# EAGLE design bluetooth_devBoard (EAGLE 6.6.0)
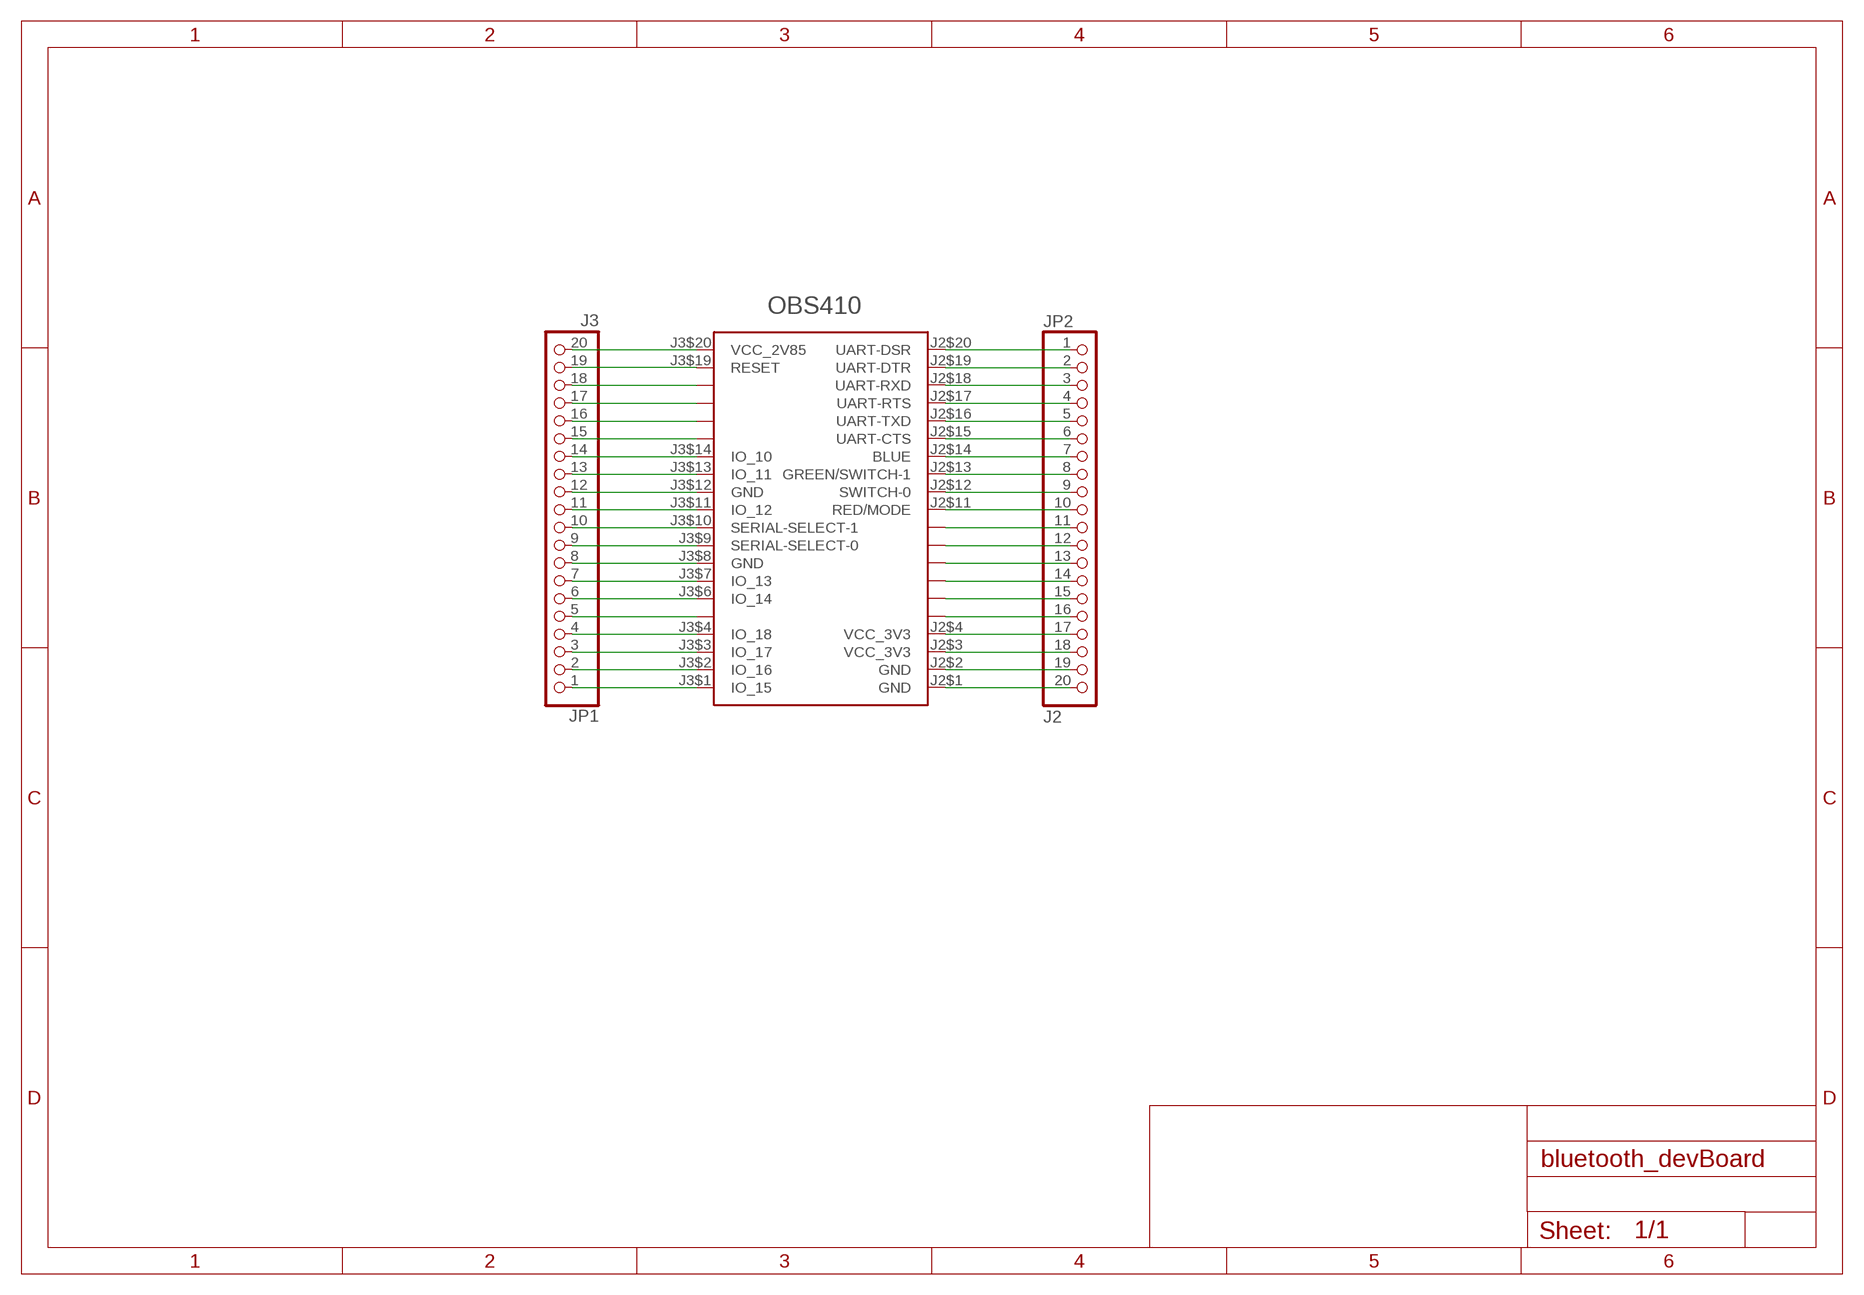
[diagram p0: schematic, sheet 1]

## Parts
JP1  J3  PINHD-1X20  [1X20]
JP2  J2  PINHD-1X20  [1X20]
U$1  OBS410  [SAMTEC-FSI-120-03-G-D-M-AB]

## Nets
GND: JP2.19 JP2.20 U$1.J2$1(GND) U$1.J2$2(GND)
N$1: JP1.20 U$1.J3$20(VCC_2V85)
N$2: JP1.19 U$1.J3$19(RESET)
N$3: JP1.18 U$1.J3$18
N$4: JP1.17 U$1.J3$17
N$5: JP1.16 U$1.J3$16
N$6: JP1.15 U$1.J3$15
N$7: JP1.14 U$1.J3$14(IO_10)
N$8: JP1.13 U$1.J3$13(IO_11)
N$9: JP1.12 U$1.J3$12(GND)
N$10: JP1.11 U$1.J3$11(IO_12)
N$11: JP1.10 U$1.J3$10(SERIAL-SELECT-1)
N$12: JP1.9 U$1.J3$9(SERIAL-SELECT-0)
N$13: JP1.8 U$1.J3$8(GND)
N$14: JP1.7 U$1.J3$7(IO_13)
N$15: JP1.6 U$1.J3$6(IO_14)
N$16: JP1.5 U$1.J3$5
N$17: JP1.4 U$1.J3$4(IO_18)
N$18: JP1.3 U$1.J3$3(IO_17)
N$19: JP1.2 U$1.J3$2(IO_16)
N$20: JP1.1 U$1.J3$1(IO_15)
N$21: JP2.1 U$1.J2$20(UART-DSR)
N$22: JP2.2 U$1.J2$19(UART-DTR)
N$23: JP2.3 U$1.J2$18(UART-RXD)
N$24: JP2.4 U$1.J2$17(UART-RTS)
N$25: JP2.5 U$1.J2$16(UART-TXD)
N$26: JP2.6 U$1.J2$15(UART-CTS)
N$27: JP2.7 U$1.J2$14(BLUE)
N$28: JP2.8 U$1.J2$13(GREEN/SWITCH-1)
N$29: JP2.9 U$1.J2$12(SWITCH-0)
N$30: JP2.10 U$1.J2$11(RED/MODE)
N$31: JP2.11 U$1.J2$10
N$32: JP2.12 U$1.J2$9
N$33: JP2.13 U$1.J2$8
N$34: JP2.14 U$1.J2$7
N$35: JP2.15 U$1.J2$6
N$36: JP2.16 U$1.J2$5
N$37: JP2.17 U$1.J2$4(VCC_3V3)
VCC_3V3: JP2.18 U$1.J2$3(VCC_3V3)

## Library data of the parts
JP1 JP2 = pinhead:PINHD-1X20: PIN HEADER
U$1 = ajgl:OBS410: Bluetooth modul BlueConnect OBS410

## Board
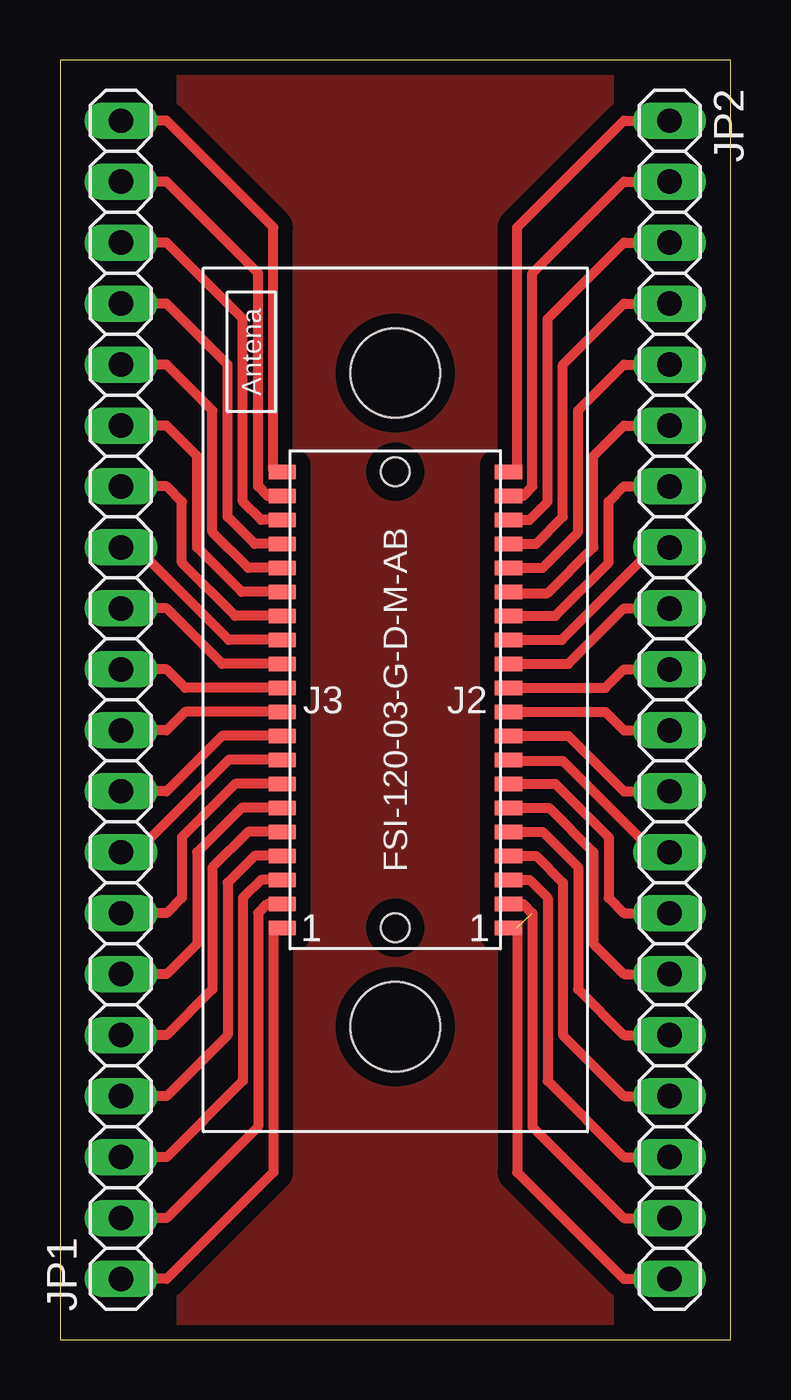
[diagram p1: board, top side]

Size 27.94 x 53.33 mm. Coordinates in mm from the lower left corner, seen from the top.
Outline: 0,0 27.94,0 27.94,53.33 0,53.33 0,0
Copper layers 1: Top 0.035mm
Design rules "design_rules *": minimum track width 30mil, minimum drill 24mil, track to track 2mil, track to pad 5mil, pad to pad 5mil, via to via 5mil, smd to smd 5mil, copper to edge 20mil, drill to drill 8mil, minimum pad ring 10mil, minimum via ring 8mil, stop-mask expansion 4mil, vias tented up to drill 0mil, thermal gap 10mil

### Footprints (pad centres in the part's own frame; a part is rotated, then mirrored left to right if it is on the bottom)
1X20 = drill 1.016 long: 1 -24.13,0; 2 -21.59,0; 3 -19.05,0; 4 -16.51,0; 5 -13.97,0; 6 -11.43,0; 7 -8.89,0; 8 -6.35,0; 9 -3.81,0; 10 -1.27,0; 11 1.27,0; 12 3.81,0; 13 6.35,0; 14 8.89,0; 15 11.43,0; 16 13.97,0; 17 16.51,0; 18 19.05,0; 19 21.59,0; 20 24.13,0
SAMTEC-FSI-120-03-G-D-M-AB = smd 1.14 x 0.61: J2$1 4.71,-9.5; J2$2 4.71,-8.5; J2$3 4.71,-7.5; J2$4 4.71,-6.5; J2$5 4.71,-5.5; J2$6 4.71,-4.5; J2$7 4.71,-3.5; J2$8 4.71,-2.5; J2$9 4.71,-1.5; J2$10 4.71,-0.5; J2$11 4.71,0.5; J2$12 4.71,1.5; J2$13 4.71,2.5; J2$14 4.71,3.5; J2$15 4.71,4.5; J2$16 4.71,5.5; J2$17 4.71,6.5; J2$18 4.71,7.5; J2$19 4.71,8.5; J2$20 4.71,9.5; J3$1 -4.71,-9.5; J3$2 -4.71,-8.5; J3$3 -4.71,-7.5; J3$4 -4.71,-6.5; J3$5 -4.71,-5.5; J3$6 -4.71,-4.5; J3$7 -4.71,-3.5; J3$8 -4.71,-2.5; J3$9 -4.71,-1.5; J3$10 -4.71,-0.5; J3$11 -4.71,0.5; J3$12 -4.71,1.5; J3$13 -4.71,2.5; J3$14 -4.71,3.5; J3$15 -4.71,4.5; J3$16 -4.71,5.5; J3$17 -4.71,6.5; J3$18 -4.71,7.5; J3$19 -4.71,8.5; J3$20 -4.71,9.5 | hole 3.73: 0,-13.62; 0,13.62 | hole 1.2: 0,9.5; 0,-9.5

### Placement (x,y rotation side)
JP1  2.54,26.67 90 top
JP2  25.4,26.67 270 top
U$1  13.97,26.67 0 top

### Tracks (layer width: path | path; a pad name or v marks a point on that pad's centre or on a via)
GND  (1 unrouted)
  Top 0.406: U$1.J2$1 19.02,17.17 19.05,17.14 19.05,6.99 23.5,2.54 JP2.20 | U$1.J2$2 19.3,18.17 19.68,17.78 19.68,8.89 23.5,5.08 JP2.19
N$1
  Top 0.406: JP1.20 4.45,50.8 8.89,46.35 8.89,36.2 8.91,36.17 U$1.J3$20
N$2
  Top 0.406: U$1.J3$19 8.64,35.17 8.26,35.56 8.26,44.45 4.45,48.26 JP1.19
N$3
  Top 0.406: U$1.J3$18 8.38,34.17 7.62,34.92 7.62,42.55 4.45,45.72 JP1.18
N$4
  Top 0.406: U$1.J3$17 8.11,33.17 6.99,34.29 6.99,40.64 4.45,43.18 JP1.17
N$5
  Top 0.406: U$1.J3$16 7.83,32.17 6.35,33.66 6.35,38.73 4.45,40.64 JP1.16
N$6
  Top 0.406: U$1.J3$15 7.57,31.17 5.71,33.02 5.71,36.83 4.45,38.1 JP1.15
N$7
  Top 0.406: U$1.J3$14 7.29,30.17 5.08,32.38 5.08,34.92 4.45,35.56 JP1.14
N$8
  Top 0.406: U$1.J3$13 7.03,29.17 3.17,33.02 JP1.13
N$9
  Top 0.406: U$1.J3$12 6.75,28.17 4.45,30.48 JP1.12
N$10
  Top 0.406: U$1.J3$11 5.21,27.17 4.45,27.94 JP1.11
N$11
  Top 0.406: U$1.J3$10 5.21,26.17 4.45,25.4 JP1.10
N$12
  Top 0.406: U$1.J3$9 6.75,25.17 4.45,22.86 JP1.9
N$13
  Top 0.406: U$1.J3$8 7.03,24.17 3.17,20.32 JP1.8
N$14
  Top 0.406: U$1.J3$7 7.29,23.17 5.08,20.95 5.08,18.41 4.45,17.78 JP1.7
N$15
  Top 0.406: U$1.J3$6 7.57,22.17 5.71,20.32 5.71,16.51 4.45,15.24 JP1.6
N$16
  Top 0.406: U$1.J3$5 7.83,21.17 6.35,19.68 6.35,14.61 4.45,12.7 JP1.5
N$17
  Top 0.406: U$1.J3$4 8.11,20.17 6.99,19.05 6.99,12.7 4.45,10.16 JP1.4
N$18
  Top 0.406: U$1.J3$3 8.38,19.17 7.62,18.41 7.62,10.79 4.45,7.62 JP1.3
N$19
  Top 0.406: U$1.J3$2 8.64,18.17 8.26,17.78 8.26,8.89 4.45,5.08 JP1.2
N$20
  Top 0.406: JP1.1 4.45,2.54 8.89,6.99 8.89,17.14 8.91,17.17 U$1.J3$1
N$21
  Top 0.406: U$1.J2$20 19.02,36.17 19.05,36.2 19.05,46.35 23.5,50.8 JP2.1
N$22
  Top 0.406: U$1.J2$19 19.3,35.17 19.68,35.56 19.68,44.45 23.5,48.26 JP2.2
N$23
  Top 0.406: U$1.J2$18 19.57,34.17 20.32,34.92 20.32,42.55 23.5,45.72 JP2.3
N$24
  Top 0.406: U$1.J2$17 19.84,33.17 20.95,34.29 20.95,40.64 23.5,43.18 JP2.4
N$25
  Top 0.406: U$1.J2$16 20.11,32.17 21.59,33.66 21.59,38.73 23.5,40.64 JP2.5
N$26
  Top 0.406: U$1.J2$15 18.47,31.17 18.41,31.11 20.32,31.11 22.23,33.02 22.23,36.83 23.5,38.1 JP2.6
N$27
  Top 0.406: U$1.J2$14 20.64,30.17 22.86,32.38 22.86,34.92 23.5,35.56 JP2.7
N$28
  Top 0.406: U$1.J2$13 20.91,29.17 24.77,33.02 JP2.8
N$29
  Top 0.406: U$1.J2$12 21.18,28.17 23.5,30.48 JP2.9
N$30
  Top 0.406: U$1.J2$11 22.73,27.17 23.5,27.94 JP2.10
N$31
  Top 0.406: U$1.J2$10 22.73,26.17 23.5,25.4 JP2.11
N$32
  Top 0.406: U$1.J2$9 21.18,25.17 23.5,22.86 JP2.12
N$33
  Top 0.406: U$1.J2$8 19.01,24.17 19.05,24.13 20.95,24.13 24.77,20.32 JP2.13
N$34
  Top 0.406: U$1.J2$7 20.64,23.17 22.86,20.95 22.86,18.41 23.5,17.78 JP2.14
N$35
  Top 0.406: U$1.J2$6 20.38,22.17 22.23,20.32 22.23,16.51 23.5,15.24 JP2.15
N$36
  Top 0.406: U$1.J2$5 20.11,21.17 21.59,19.68 21.59,14.61 23.5,12.7 JP2.16
N$37
  Top 0.406: U$1.J2$4 19.84,20.17 20.95,19.05 20.95,12.7 23.5,10.16 JP2.17
N$38
  pour Top (isolate 0.61): 5.08,52.7 22.86,52.7 22.86,0.64 5.08,0.64
VCC_3V3
  Top 0.406: U$1.J2$3 19.57,19.17 20.32,18.41 20.32,10.79 23.5,7.62 JP2.18